# EAGLE design main (EAGLE 7.1.0)
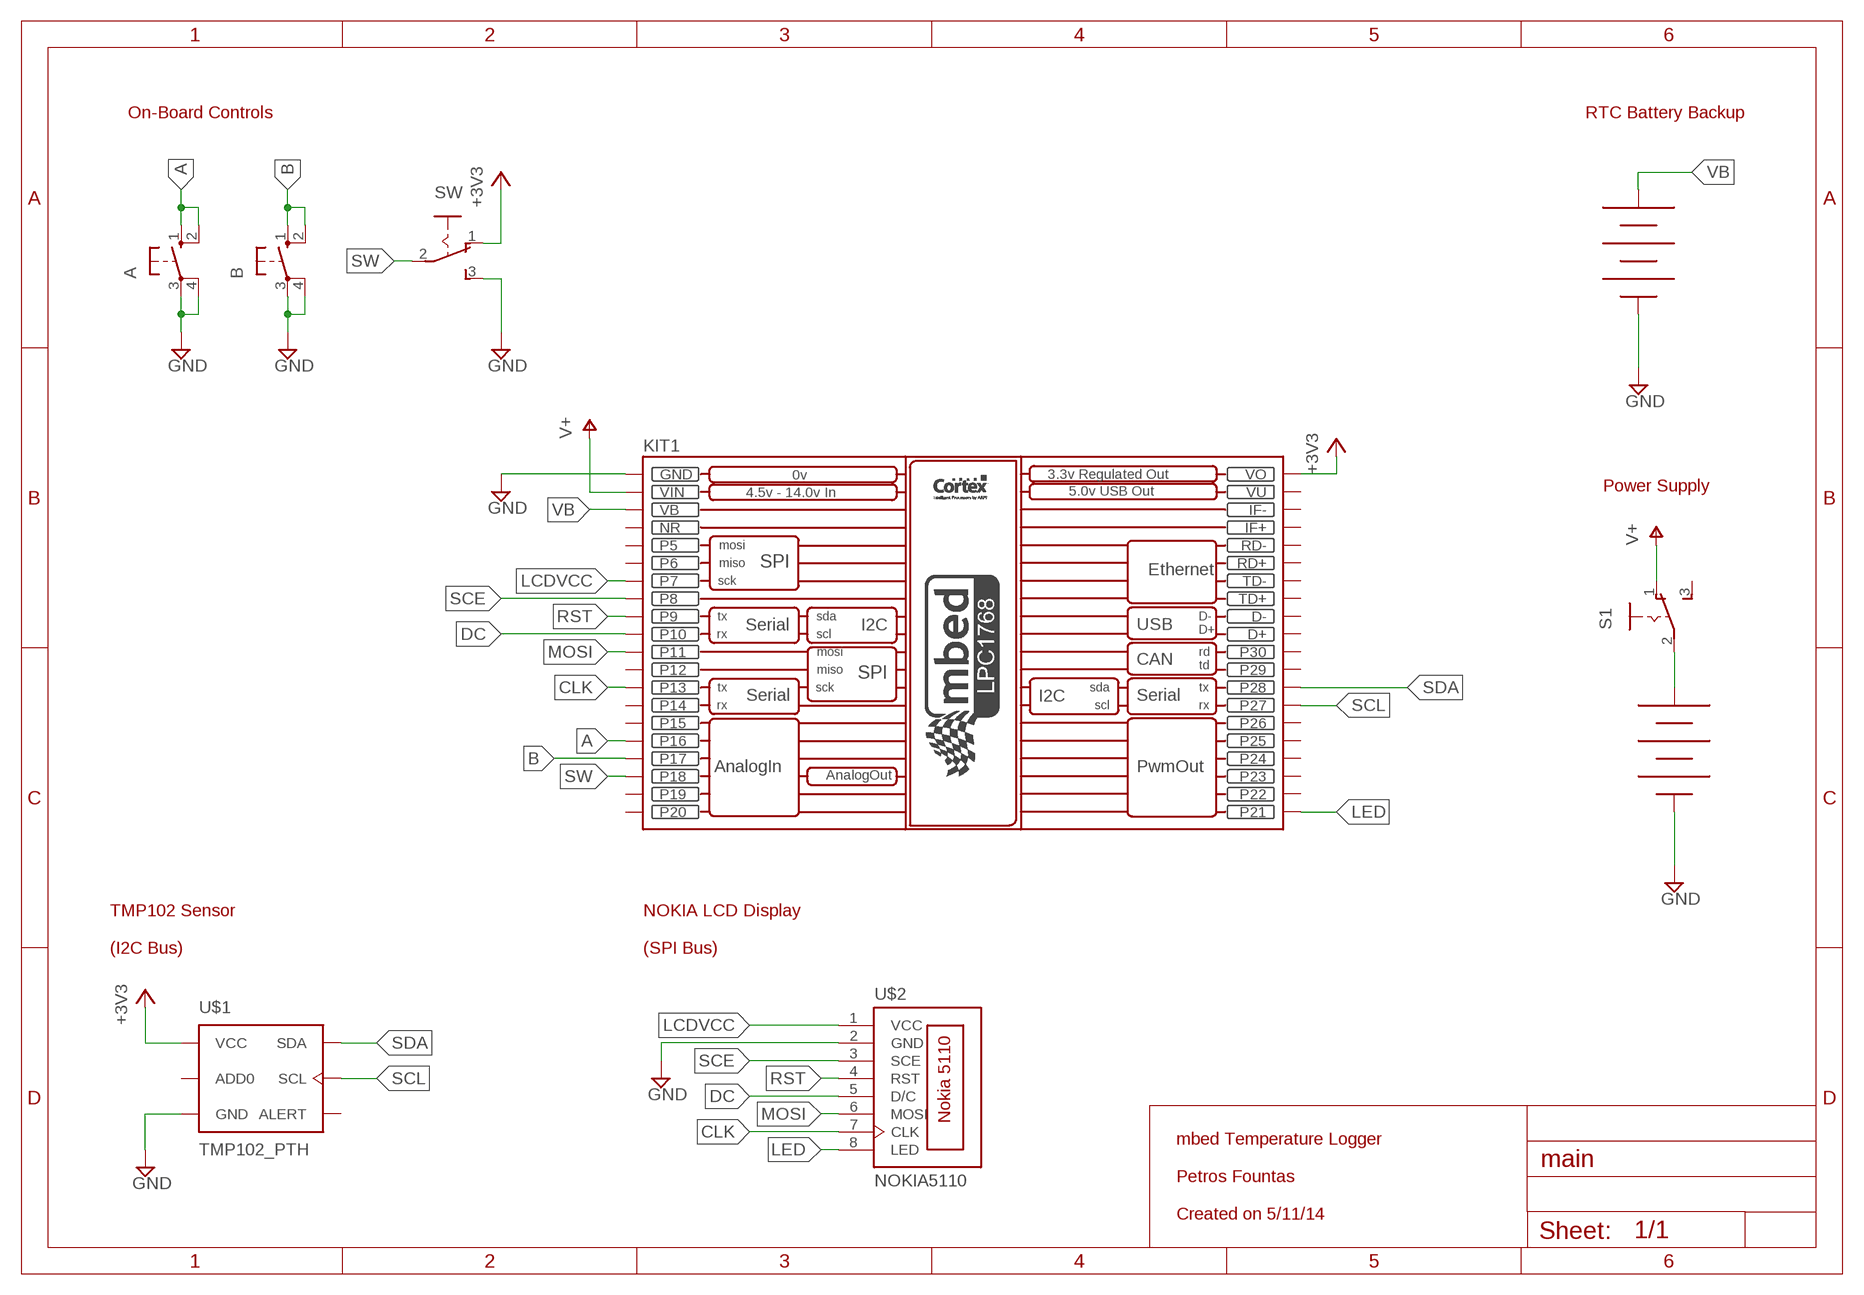
[diagram p0: schematic, sheet 1]

## Parts
A  BUTTON_THT  [BUTTON]
B  BUTTON_THT  [BUTTON]
BATT1  BATTERY_4AA  [BATTERY_4AA]
BATT2  BATTERY_H_CR2032  [BATTERY_H]
KIT1  MBED_SILK  [MBED]
S1  M251  [M251]
SW  M251  [M251]
U$1  TMP102_PTH  [TMP102]
U$2  NOKIA5110  [NOKIA5110]

## Nets
+3V3: KIT1.VOUT(VO) SW.1(O) U$1.VCC
A: A.1(S) A.2(S1) KIT1.P$16(P16)
B: B.1(S) B.2(S1) KIT1.P$17(P17)
CLK: KIT1.P$13(P13) U$2.7(CLK)
DC: KIT1.P$10(P10) U$2.5(D/C)
GND: A.3(P) A.4(P1) B.3(P) B.4(P1) BATT1.- BATT2.- KIT1.GND SW.3(S) U$1.GND U$2.2(GND)
LCDVCC: KIT1.P$7(P7) U$2.1(VCC)
LED: KIT1.P$21(P21) U$2.8(LED)
MOSI: KIT1.P$11(P11) U$2.6(MOSI)
N$1: BATT1.+ S1.2(P)
RST: KIT1.P$9(P9) U$2.4(RST)
SCE: KIT1.P$8(P8) U$2.3(SCE)
SCL: KIT1.P$27(P27) U$1.SCL
SDA: KIT1.P$28(P28) U$1.SDA
SW: KIT1.P$18(P18) SW.2(P)
V+: KIT1.VIN S1.1(O)
VB: BATT2.+ KIT1.VB
Unconnected: KIT1.D+ KIT1.D- KIT1.IF+ KIT1.IF- KIT1.P$5(P5) KIT1.P$6(P6) KIT1.P$12(P12) KIT1.P$14(P14) KIT1.P$15(P15) KIT1.P$19(P19) KIT1.P$20(P20) KIT1.P$22(P22) KIT1.P$23(P23) KIT1.P$24(P24) KIT1.P$25(P25) KIT1.P$26(P26) KIT1.P$29(P29) KIT1.P$30(P30) KIT1.RD+ KIT1.RD- KIT1.TD+ KIT1.TD- S1.3(S) U$1.ADD0 U$1.ALERT

## Notes on the sheet
- On-Board Controls | RTC Battery Backup
- Power Supply
- TMP102 Sensor
  
  (I2C Bus)
- NOKIA LCD Display
  
  (SPI Bus)
- mbed Temperature Logger
  
  Petros Fountas
  
  Created on 5/11/14

## Power pins joined to a net without a drawn wire
NR: KIT1.NR
VU: KIT1.VU

## Library data of the parts
A B = eencae:BUTTON: OMRON SWITCH; MPN: B3F-1000; OC_FARNELL: 176432; OC_NEWARK: 36M3542
BATT1 BATT2 = eencae:BATTERY
KIT1 = eencae:MBED: mbed LPC1768
S1 SW = switch:M251: SLIDING SWITCH Mors, distributor Buerklin, 11G702
U$1 = eencae:TMP102
U$2 = eencae:NOKIA5110

## Board
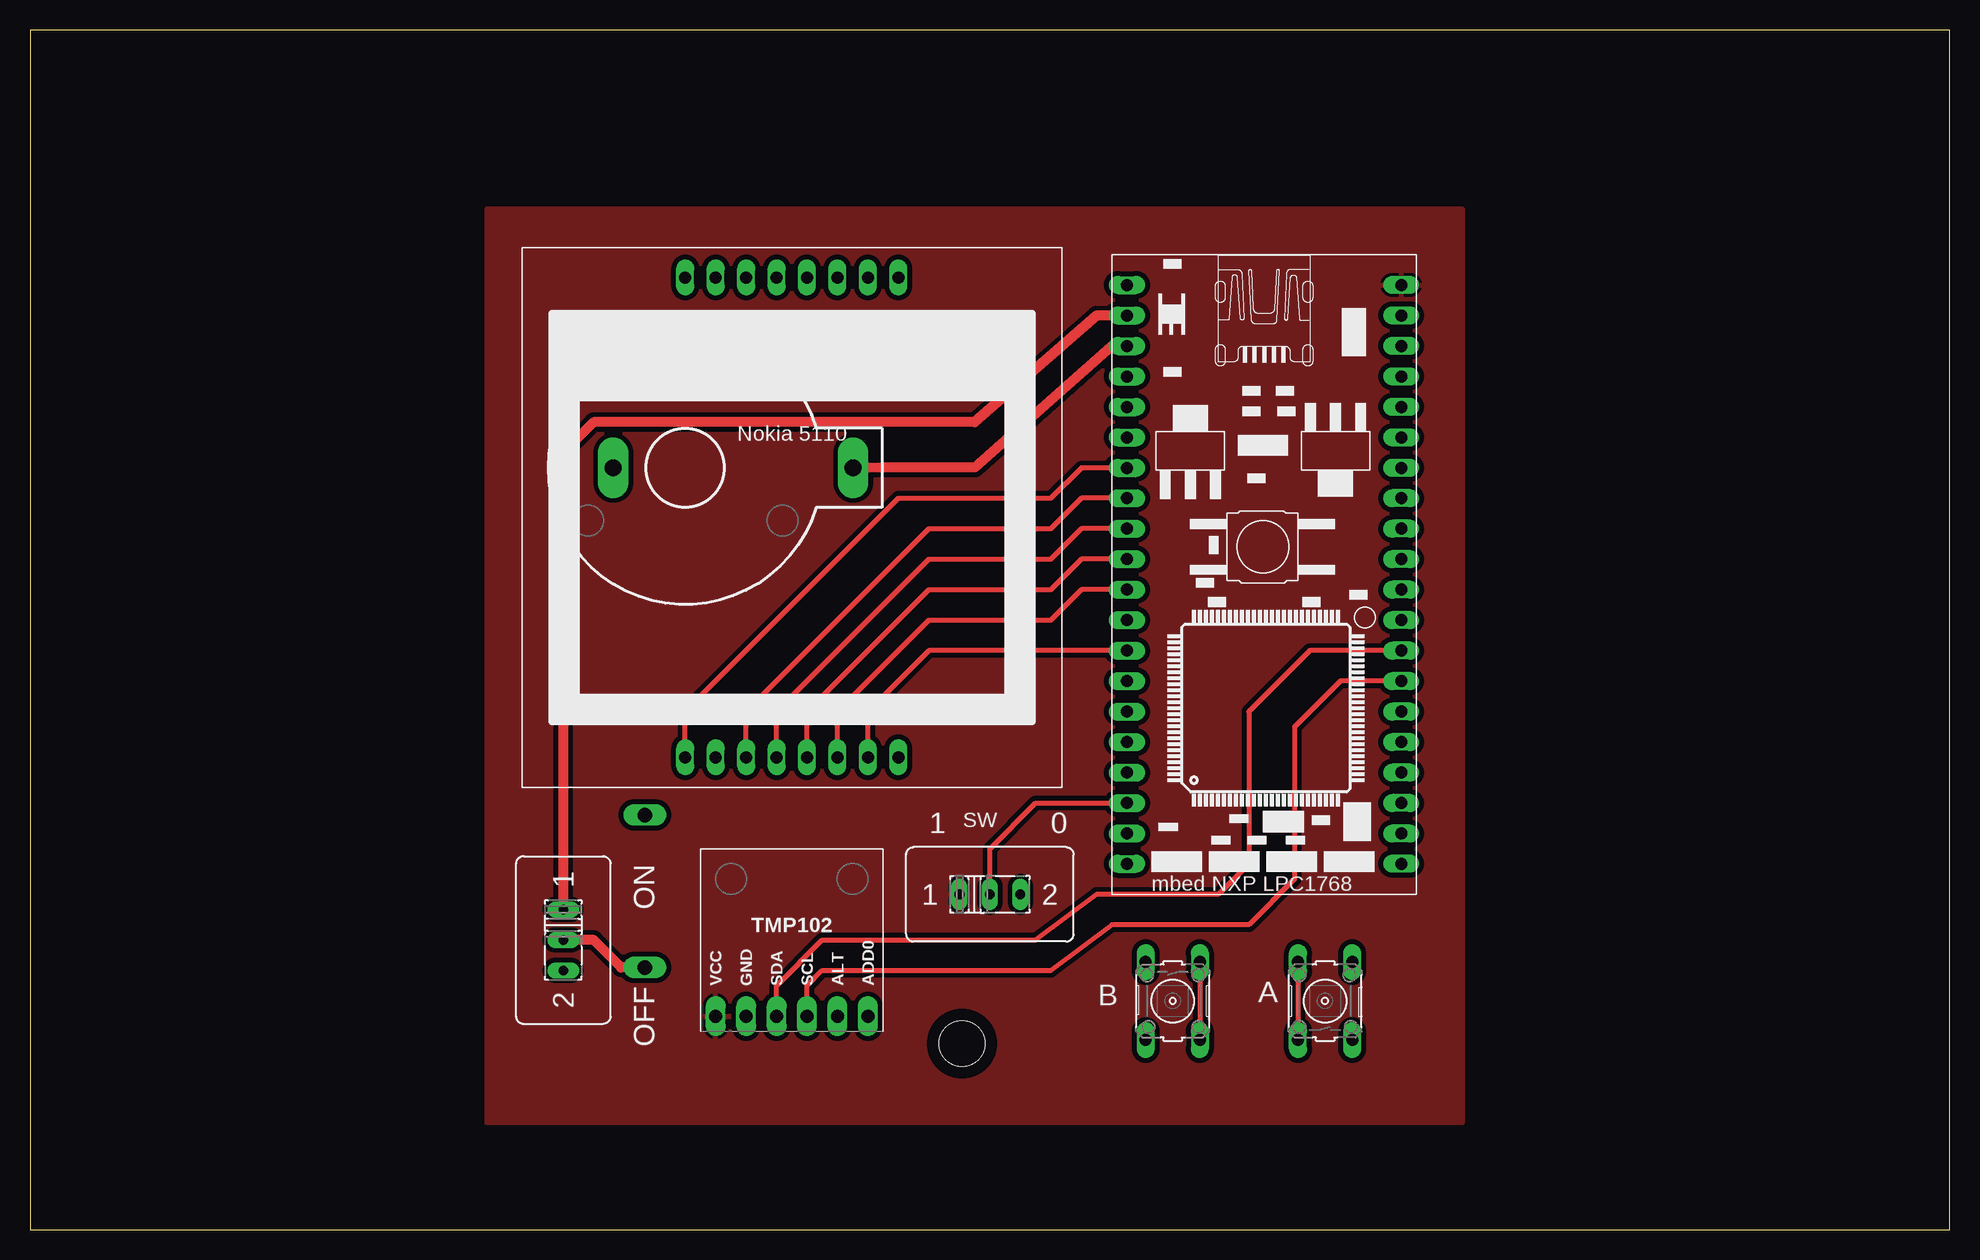
[diagram p1: board, top side]
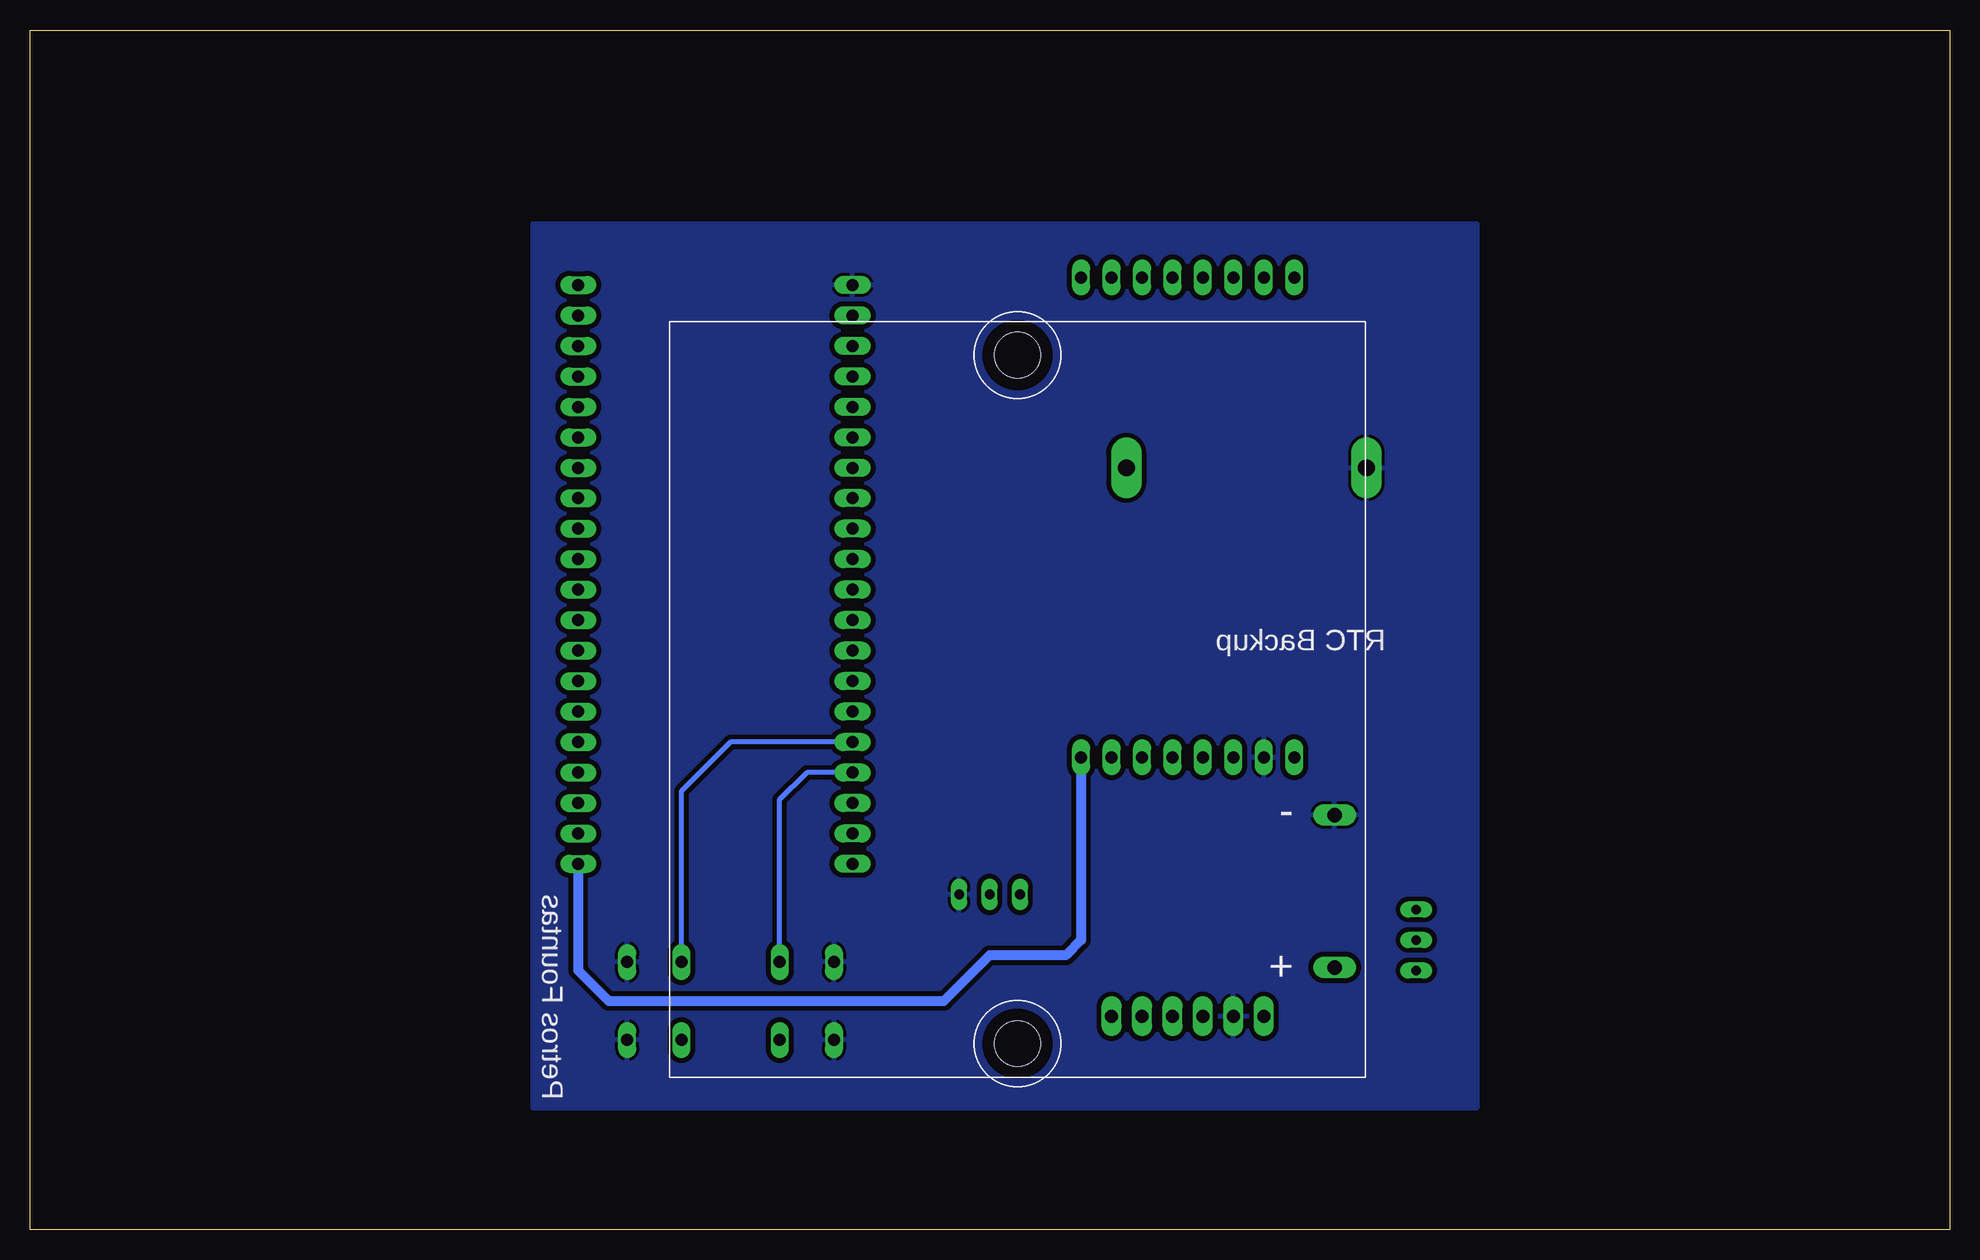
[diagram p2: board, bottom side, seen from below]

Size 160 x 100 mm. Coordinates in mm from the lower left corner, seen from the top.
Outline: 0,0 160,0 160,100 0,100 0,0
Copper layers (1*16): Top 0.035mm / dielectric 1.5mm / Bottom 0.035mm
Design rules "default": minimum track width 10mil, minimum drill 24mil, track to track 8mil, track to pad 8mil, pad to pad 8mil, via to via 8mil, smd to smd 8mil, copper to edge 40mil, drill to drill 8mil, minimum pad ring 10mil, minimum via ring 8mil, stop-mask expansion 4mil, vias tented up to drill 0mil, thermal gap 10mil

### Footprints (pad centres in the part's own frame; a part is rotated, then mirrored left to right if it is on the bottom)
BUTTON = drill 1 long: 1 -3.251,2.261; 2 3.251,2.261; 3 -3.251,-2.261; 4 3.251,-2.261
BATTERY_4AA = drill 1.2 long: + 55.42,9.15; - 55.42,21.85 | hole 3.8: 29,2.8; 29,60.2
BATTERY_H = drill 1.4 pad 2.54 long: + 0,-14; - 0,6
MBED = drill 1 long: D+ 11.43,1.27; D- 11.43,3.81; GND -11.43,24.13; IF+ 11.43,16.51; IF- 11.43,19.05; NR -11.43,16.51; P$5 -11.43,13.97; P$6 -11.43,11.43; P$7 -11.43,8.89; P$8 -11.43,6.35; P$9 -11.43,3.81; P$10 -11.43,1.27; P$11 -11.43,-1.27; P$12 -11.43,-3.81; P$13 -11.43,-6.35; P$14 -11.43,-8.89; P$15 -11.43,-11.43; P$16 -11.43,-13.97; P$17 -11.43,-16.51; P$18 -11.43,-19.05; P$19 -11.43,-21.59; P$20 -11.43,-24.13; P$21 11.43,-24.13; P$22 11.43,-21.59; P$23 11.43,-19.05; P$24 11.43,-16.51; P$25 11.43,-13.97; P$26 11.43,-11.43; P$27 11.43,-8.89; P$28 11.43,-6.35; P$29 11.43,-3.81; P$30 11.43,-1.27; RD+ 11.43,11.43; RD- 11.43,13.97; TD+ 11.43,6.35; TD- 11.43,8.89; VB -11.43,19.05; VIN -11.43,21.59; VOUT 11.43,24.13; VU 11.43,21.59
M251 = drill 0.813 long: 1 -2.54,0; 2 0,0; 3 2.54,0
TMP102 = drill 1.1 long: ADD0 13.97,1.27; ALERT 11.43,1.27; GND 3.81,1.27; SCL 8.89,1.27; SDA 6.35,1.27; VCC 1.27,1.27
NOKIA5110 = drill 1 long: 1 -8.89,0; 2 -6.35,0; 3 -3.81,0; 4 -1.27,0; 5 1.27,0; 6 3.81,0; 7 6.35,0; 8 8.89,0; 9 -1.27,40; 10 -3.81,40; 11 -6.35,40; 12 -8.89,40; 13 1.27,40; 14 3.81,40; 15 6.35,40; 16 8.89,40

### Placement (x,y rotation side)
A  107.95,19.05 90 top
B  95.25,19.05 270 top
BATT1  106.68,12.7 0 bottom
BATT2  54.61,63.5 90 top
KIT1  102.87,54.61 0 top
S1  44.45,24.13 270 top
SW  80.01,27.94 0 top
U$1  55.88,16.51 0 top
U$2  63.5,39.37 0 top

### Tracks (layer width: path | path; a pad name or v marks a point on that pad's centre or on a via)
+3V3
  pour Top (isolate 0.406): 38.1,85.09 119.38,85.09 119.38,8.89 38.1,8.89
A
  Top 0.406: A.2 A.1
  Bottom 0.406: A.2 105.69,36.55 101.6,40.64 KIT1.P$16
B
  Top 0.406: B.1 B.2
  Bottom 0.406: KIT1.P$17 95.25,38.1 97.51,35.84 B.1
CLK
  Top 0.406: KIT1.P$13 74.93,48.26 69.85,43.18 U$2.7
DC
  Top 0.406: KIT1.P$10 87.63,55.88 85.09,53.34 74.93,53.34 64.77,43.18 U$2.5
GND
  pour Bottom (isolate 0.406): 39.37,83.82 118.11,83.82 118.11,10.16 39.37,10.16
LCDVCC
  Top 0.406: KIT1.P$7 87.63,63.5 85.09,60.96 72.39,60.96 54.61,43.18 U$2.1
LED
  Bottom 0.813: U$2.8 72.39,24.13 73.66,22.86 80.01,22.86 83.82,19.05 111.76,19.05 114.3,21.59 KIT1.P$21
MOSI
  Top 0.406: KIT1.P$11 87.63,53.34 85.09,50.8 74.93,50.8 67.31,43.18 U$2.6
N$1
  Top 0.813: BATT1.+ 49.27,21.85 46.99,24.13 S1.2
RST
  Top 0.406: KIT1.P$9 87.63,58.42 85.09,55.88 74.93,55.88 62.23,43.18 U$2.4
SCE
  Top 0.406: KIT1.P$8 87.63,60.96 85.09,58.42 74.93,58.42 59.69,43.18 U$2.3
SCL
  Top 0.406: KIT1.P$27 109.22,45.72 105.41,41.91 105.41,29.21 101.6,25.4 90.17,25.4 85.09,21.59 66.04,21.59 64.77,20.32 U$1.SCL
SDA
  Top 0.406: KIT1.P$28 106.68,48.26 101.6,43.18 101.6,30.48 99.06,27.94 88.9,27.94 83.82,24.13 66.04,24.13 62.23,20.32 U$1.SDA
SW
  Top 0.406: SW.2 80.01,31.75 83.82,35.56 KIT1.P$18
V+
  Top 0.813: KIT1.VIN 88.9,76.2 78.74,67.31 46.99,67.31 44.45,64.77 S1.1
VB
  Top 0.813: KIT1.VB 90.17,73.66 78.77,63.53 71.18,63.53 BATT2.+

### Text on the board
tPlace: 1 | 0 | ON | OFF
bPlace: RTC Backup | Petros Fountas